# Altium schematic sheet Audio_Actual.SchDoc
size A4; PageSetup: Record=PageOptions|CenterHorizontal=True|CenterVertical=True|PrintScale=0.97|XCorrection=1.00|YCorrection=1.00|PrintKind=0|BorderSize=5000000|LeftOffset=0|BottomOffset=0|Orientation=2|PaperLength=1000|PaperWidth=1000|Scale=100|PaperSource=7|PrintQuality=-3|MediaType=1|DitherType=10|PrintScaleMode=1|PaperKind=A4|PaperIndex=9
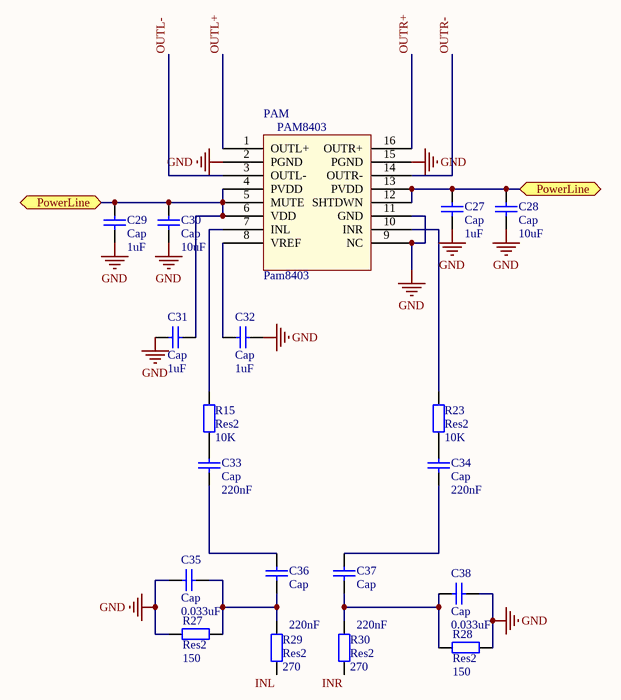
[diagram p0: Audio_Actual.SchDoc]

## Parts
C27  Cap  value 1uF  [0805]
C28  Cap  value 10uF  [0805]
C29  Cap  value 1uF  [0805]
C30  Cap  value 10uF  [0805]
C31  Cap  value 1uF  [0805]
C32  Cap  value 1uF  [0805]
C33  Cap  value 220nF  [0805]
C34  Cap  value 220nF  [0805]
C35  Cap  value 0.033uF  [0805]
C36  Cap  value 220nF  [RES-1206in]
C37  Cap  value 220nF  [RES-1206in]
C38  Cap  value 0.033uF  [0805]
PAM  Pam8403  [pam8403 Sop16]
R15  Res2  value 10K  [0805]
R23  Res2  value 10K  [0805]
R27  Res2  value 150  [0805]
R28  Res2  value 150  [0805]
R29  Res2  value 270  [0805]
R30  Res2  value 270  [0805]

## Ports
PowerLine

## Nets
GND: C27.2 C28.1 C29.2 C30.1 C31.1 C32.2 C35.2 C38.1 PAM.2(PGND) PAM.9(NC) PAM.11(GND) PAM.15(PGND) R27.2 R28.1
INL: R29.1
INR: R30.1
OUTL+: PAM.1(OUTL+)
OUTL-: PAM.3(OUTL-)
OUTR+: PAM.16(OUTR+)
OUTR-: PAM.14(OUTR-)
PowerLine: C27.1 C28.2 C29.1 C30.2 C31.2 PAM.4(PVDD) PAM.5(MUTE) PAM.6(VDD) PAM.12(SHTDWN) PAM.13(PVDD) ; port PowerLine
NetC32_1: C32.1 PAM.8(VREF)
NetC33_1: C33.1 C36.2
NetC33_2: C33.2 R15.1
NetC34_1: C34.1 C37.2
NetC34_2: C34.2 R23.1
NetC35_1: C35.1 C36.1 R27.1 R29.2
NetC37_1: C37.1 C38.2 R28.2 R30.2
NetPAM_7: PAM.7(INL) R15.2
NetPAM_10: PAM.10(INR) R23.2

## Notes on the sheet
- (in symbol Pam8403) PAM8403

## Library data of the parts
C27-C38 = Cap: Capacitor; Published: 8-Jun-2000; LatestRevisionDate: 17-Jul-2002; LatestRevisionNote: Re-released for DXP Platform.; PackageReference: RAD-0.3; Publisher: Altium Limited; PackageDescription: Radial Cap, Thru-Hole; 2 Leads; 0.3 in Pin Spacing
R15 R23 R27-R30 = Res2: Resistor; Published: 8-Jun-2000; LatestRevisionDate: 17-Jul-2002; LatestRevisionNote: Re-released for DXP Platform.; PackageReference: AXIAL-0.4; Publisher: Altium Limited; PackageDescription: Axial Device, Thru-Hole; 2 Leads; 0.4 in Pin Spacing